# EAGLE design microscope_board (EAGLE 6.5.0)
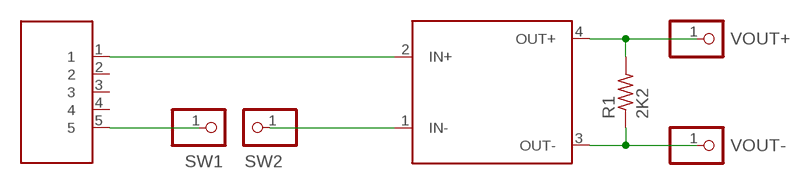
[diagram p0: schematic, sheet 1]

## Parts
R1  2K2  R-US_R0805  [R0805]
SW1  PINHD-1X1  [1X01]
SW2  PINHD-1X1  [1X01]
U$1  DC_DC  [DC_DC]
U$2  USB_CONNECTOR  [USB_CONNECTOR]
VOUT+  PINHD-1X1  [1X01]
VOUT-  PINHD-1X1  [1X01]

## Nets
N$1: R1.2 U$1.4(OUT+) VOUT+.1
N$2: R1.1 U$1.3(OUT-) VOUT-.1
N$3: U$1.2(IN+) U$2.1
N$4: SW1.1 U$2.5
N$5: SW2.1 U$1.1(IN-)
Unconnected: U$2.2 U$2.3 U$2.4

## Library data of the parts
R1 = microscope_board:R-US_: RESISTOR, American symbol
SW1 SW2 VOUT+ VOUT- = microscope_board:PINHD-1X1: PIN HEADER
U$1 = microscope_board:DC_DC
U$2 = microscope_board:USB_CONNECTOR

## Board
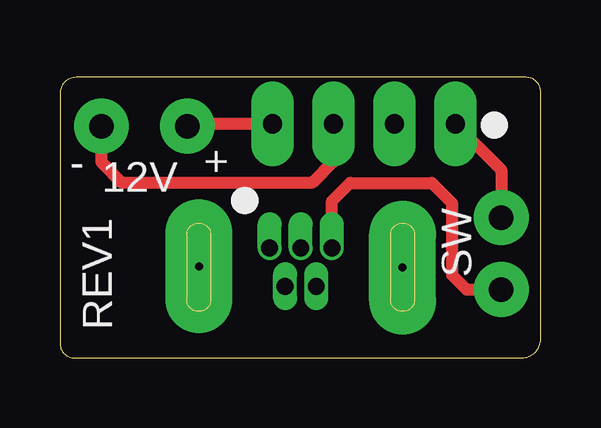
[diagram p1: board, top side]
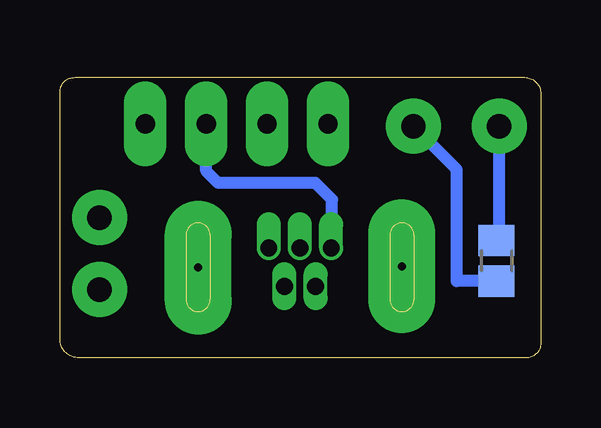
[diagram p2: board, bottom side, seen from below]

Size 20.05 x 11.7 mm. Coordinates in mm from the lower left corner, seen from the top.
Outline: 0,11.03 0,0.6 arc90 0.6,0 19.27,0 arc90 20.05,0.78 20.05,11.09 arc90 19.44,11.7 0.67,11.7 arc90 0,11.03
Copper layers (1*16): Top 0.035mm / dielectric 1.5mm / Bottom 0.035mm
Design rules "default *": minimum track width 10mil, minimum drill 24mil, track to track 8mil, track to pad 8mil, pad to pad 8mil, via to via 8mil, smd to smd 8mil, copper to edge 0mil, drill to drill 8mil, minimum pad ring 5mil, minimum via ring 8mil, stop-mask expansion 4mil, vias tented up to drill 0mil, thermal gap 10mil

### Footprints (pad centres in the part's own frame; a part is rotated, then mirrored left to right if it is on the bottom)
R0805 = smd 1.3 x 1.5: 1 -0.85,0; 2 0.85,0
1X01 = drill 1.016 pad 2.286: 1 0,0
DC_DC = drill 0.8 pad 1.778 long: 1 3.81,0; 2 1.27,0; 3 -1.27,0; 4 -3.81,0
USB_CONNECTOR = drill 0.7 pad 1 offset: 1 -1.3,0; 3 0,0; 5 1.3,0 | drill 0.7 pad 1 long: 2 -0.65,-1.6; 4 0.65,-1.6 | drill 0.33 pad 2.794 long: P$1 -4.245,-0.765; P$2 4.245,-0.815

### Placement (x,y rotation side)
R1  1.85,4.05 270 bottom
SW1  18.4,2.85 0 top
SW2  18.4,5.85 0 top
U$1  12.68,9.76 0 top
U$2  10.04,4.58 0 top
VOUT+  5.31,9.66 0 top
VOUT-  1.73,9.66 0 top

### Tracks (layer width: path | path; a pad name or v marks a point on that pad's centre or on a via)
N$1
  Top 0.508: U$1.4 5.41,9.76 VOUT+.1
  Bottom 0.508: R1.2 3.5,3.2 3.5,7.85 VOUT+.1
N$2
  Top 0.508: U$1.3 11.41,8.21 10.5,7.3 2.6,7.3 1.73,8.17 VOUT-.1
  Bottom 0.508: R1.1 1.73,4.9 VOUT-.1
N$3
  Bottom 0.508: U$2.1 8.7,4.62 8.7,6.6 9.4,7.3 13.45,7.3 13.95,7.8 U$1.2
N$4
  Top 0.508: U$2.5 11.35,6.55 12.1,7.3 15.5,7.3 16.35,6.45 16.35,3.45 16.95,2.85 SW1.1
N$5
  Top 0.508: U$1.1 18.4,7.85 SW2.1

### Text on the board
tPlace: - | + | 12V | SW | REV1